# EAGLE design thg-probe (EAGLE 9.3.0)
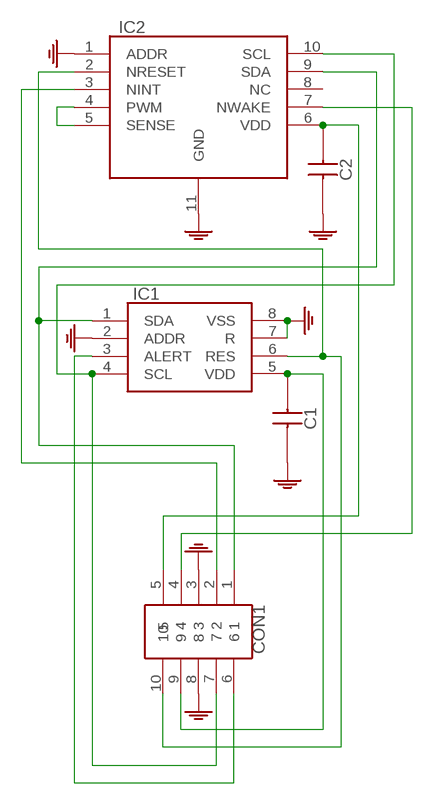
[diagram p0: schematic, sheet 1]

## Parts
C1  CAPACITOR-0603  [0603]
C2  CAPACITOR-0603  [0603]
CON1  HEADER-10P-2R-DIP-2_54MM  [HEADER-10P-2R-DIP-2_54MM]
IC1  SHT3X-DIS  [SHT3X-DIS]
IC2  CCS811B-JOPD500  [LGA-10]

## Nets
GND: C1.2 C2.2 CON1.3 CON1.8 IC1.2(ADDR) IC1.7(R) IC1.8(VSS) IC2.1(ADDR) IC2.11(GND)
N$2: CON1.10 IC1.6(RES) IC2.2(NRESET)
N$3: C1.1 CON1.9 IC1.5(VDD)
N$4: C2.1 CON1.5 IC2.6(VDD)
N$5: CON1.4 IC2.7(NWAKE)
N$6: CON1.1 IC1.1(SDA) IC2.9(SDA)
N$8: IC2.4(PWM) IC2.5(SENSE)
N$9: CON1.2 IC2.3(NINT)
N$10: CON1.7 IC1.4(SCL) IC2.10(SCL)
N$12: CON1.6 IC1.3(ALERT)
Unconnected: IC2.8(NC)

## Library data of the parts
C1 C2 = SamacSys_Parts:CAPACITOR-0603
CON1 = SamacSys_Parts:HEADER-10P-2R-DIP-2_54MM
IC1 = SamacSys_Parts:SHT3X-DIS
IC2 = SamacSys_Parts:CCS811B-JOPD500

## Board
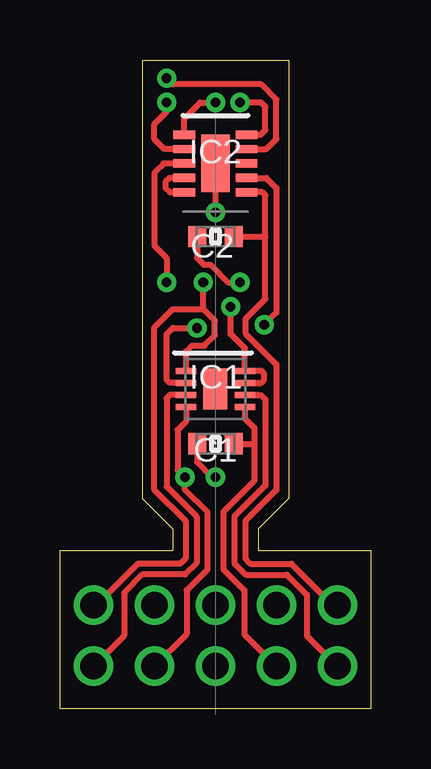
[diagram p1: board, top side]
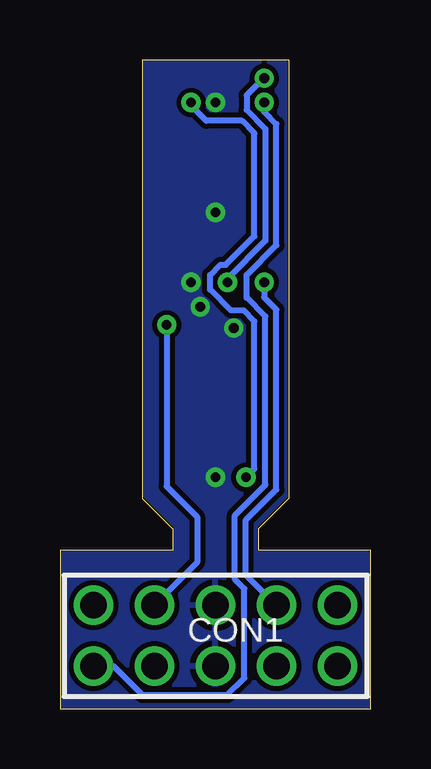
[diagram p2: board, bottom side, seen from below]

Size 12.95 x 27.05 mm. Coordinates in mm from the lower left corner, seen from the top.
Outline: 0,0 0,6.6 4.7,6.6 4.7,7.49 3.43,8.76 3.43,27.05 9.53,27.05 9.53,8.76 8.26,7.49 8.26,6.6 12.95,6.6 12.95,0 0,0
Copper layers (1*16): Top 0.035mm / dielectric 1.5mm / Bottom 0.035mm
Design rules "qfn": minimum track width 10mil, minimum drill 0.4mm, track to track 8mil, track to pad 10mil, pad to pad 8mil, via to via 8mil, smd to smd 0mil, copper to edge 0mil, drill to drill 6mil, minimum pad ring 10mil, minimum via ring 8mil, stop-mask expansion 4mil, vias tented up to drill 25mil, thermal gap 10mil

### Footprints (pad centres in the part's own frame; a part is rotated, then mirrored left to right if it is on the bottom)
0603 = smd 0.762 x 0.889: 1 -0.762,0; 2 0.762,0
HEADER-10P-2R-DIP-2_54MM = drill 1.1 pad 1.65: 1 0,0; 2 2.54,0; 3 5.08,0; 4 7.62,0; 5 10.16,0; 6 0,2.54; 7 2.54,2.54; 8 5.08,2.54; 9 7.62,2.54; 10 10.16,2.54
SHT3X-DIS = smd 0.85 x 0.254: 1 -1.225,0.75; 2 -1.225,0.25; 3 -1.225,-0.25; 4 -1.225,-0.75; 5 1.225,-0.75; 6 1.225,-0.25; 7 1.225,0.25; 8 1.225,0.75 | smd 1 x 1.7: 9 0,0
LGA-10 = smd 0.9 x 0.35: 1 -1.3,1.2; 2 -1.3,0.6; 3 -1.3,0; 4 -1.3,-0.6; 5 -1.3,-1.2; 6 1.3,-1.2; 7 1.3,-0.6; 8 1.3,0; 9 1.3,0.6; 10 1.3,1.2 | smd 1.2 x 2.4: 11 0,0

### Placement (x,y rotation side)
C1  6.48,11.05 180 top
C2  6.48,19.68 180 top
CON1  1.4,4.32 180 bottom
IC1  6.48,13.33 0 top
IC2  6.48,22.73 0 top

### Tracks (layer width: path | path; a pad name or v marks a point on that pad's centre or on a via)
GND  (via drill 0.4)
  Top 0.254: IC1.2 4.58,13.58 4.45,13.72 4.45,15.62 4.7,15.88 v5.71,15.88 | v7.11,16.76 7.11,15.62 7.7,15.03 IC1.8 8.39,14.08 8.51,13.97 8.51,13.72 8.38,13.59 8.26,13.59 8.25,13.58 IC1.7 | C1.2 5.71,10.29 6.35,9.65 v6.48,9.65 | IC2.1 5.18,24.61 5.84,25.27 v6.48,25.27 | C2.2 5.71,18.8 6,18.51 6.27,18.51 7.01,17.78 v7.49,17.78 | IC2.11 v6.48,20.7
  pour Bottom: 0.13,0.13 0.13,6.48 4.83,6.48 4.83,7.49 4.83,7.62 3.56,8.89 3.56,9.02 3.56,26.92 9.4,26.92 9.4,8.89 9.27,8.76 8.13,7.62 8.13,6.48 12.83,6.48 12.83,0.13
N$2  (via drill 0.4)
  Top 0.254: CON1.10 10.29,3.05 10.29,4.75 9.45,5.59 7.75,5.59 7.26,6.07 7.26,8.02 8.56,9.31 8.56,12.9 8.38,13.08 8.26,13.08 8.25,13.08 IC1.6 | IC2.2 4.35,23.33 3.94,23.75 3.94,24.38 4.45,24.89 v4.45,25.27
  Bottom 0.254: CON1.10 10.72,1.78 9.52,0.57 5.98,0.57 5.27,1.28 5.27,5 5.66,5.4 5.66,8.06 4.39,9.33 4.39,16.35 5.18,17.14 5.18,18.08 3.94,19.32 3.94,24.38 4.45,24.89 v4.45,25.27
N$3
  Top 0.254: CON1.9 7.68,3.11 7.68,4.94 6.81,5.82 6.81,8.2 8.1,9.5 8.1,11.05 | IC1.5 7.7,12.11 8.1,11.71 8.1,11.05 | C1.1 8.1,11.05
N$4
  Top 0.254: CON1.5 11.37,4.32 9.64,6.04 7.94,6.04 7.72,6.26 7.72,7.82 9.02,9.12 9.02,14.36 7.75,15.63 7.75,16.28 8.56,17.09 8.56,19.68 | IC2.6 8.44,21.53 8.56,21.41 8.56,19.68 | C2.1 8.56,19.68
N$5  (via drill 0.4)
  Top 0.254: v8.51,16 9.02,16.51 9.02,21.71 8.6,22.13 IC2.7
  Bottom 0.254: v8.51,16 8.51,9.27 7.24,8 7.24,6.1 CON1.4
N$6  (via drill 0.4)
  Top 0.254: CON1.1 1.51,4.32 3.25,6.05 5.01,6.05 5.23,6.27 5.23,7.82 3.94,9.12 3.94,15.9 4.7,16.66 5.97,16.66 | IC2.9 8.6,23.33 9.02,23.75 9.02,25.4 8.38,26.04 4.7,26.04 v4.45,26.29 | 5.97,16.66 v5.97,17.78 | 5.97,16.66 6.45,16.18 6.45,15.57 6.02,15.14 5.49,15.14 5.25,14.9 IC1.1
  Bottom 0.254: v4.45,26.29 4.73,26.01 4.75,26.01 5.18,25.58 5.18,24.97 4.39,24.18 4.39,19.52 5.97,17.94 v5.97,17.78
N$8
  Top 0.254: IC2.4 4.56,22.13 4.39,21.97 4.39,21.72 4.58,21.53 IC2.5
N$9  (via drill 0.4)
  Top 0.254: IC2.3 4.32,22.73 3.94,22.35 3.94,19.3 4.45,18.8 v4.45,17.78
  Bottom 0.254: CON1.2 5.21,5.59 5.21,7.87 3.94,9.14 3.94,16.64 4.45,17.14 v4.45,17.78
N$10  (via drill 0.4)
  Top 0.254: CON1.7 5.27,3.11 5.27,4.94 6.15,5.82 6.15,8.2 5.21,9.14 v5.21,9.65 4.9,9.96 4.9,11.63 5.25,11.98 IC1.4 | IC2.10 8.36,23.93 8.56,24.13 8.56,25.09 8.38,25.27 v7.49,25.27
  Bottom 0.254: v5.21,9.65 4.85,10.01 4.85,16.15 5.3,16.61 5.83,16.61 6.7,17.48 6.7,18.08 6.27,18.51 6.04,18.51 4.85,19.7 4.85,24 5.37,24.51 6.86,24.51 7.49,25.15 v7.49,25.27
N$12
  Top 0.254: IC1.3 4.58,13.08 4.45,12.95 4.45,9.26 5.69,8.02 5.69,6.08 5.2,5.59 3.44,5.59 2.67,4.83 2.67,3.05 CON1.6